# Altium schematic sheet Regulador_Inversor.SchDoc
size A4; SheetNumber: 1; SheetTotal: 1
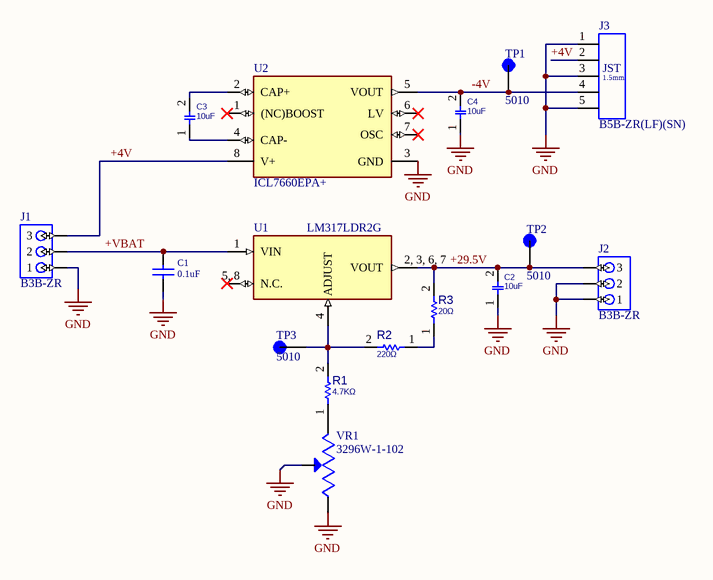
[diagram p0: Regulador_Inversor.SchDoc]

## Parts
C1  0.1uF  [CAPC2013X113X30LL10T10]
C2  10uF  [C1210]
C3  10uF  [C1210]
C4  10uF  [C1210]
J1  B3B-ZR  [B3B-ZR]
J2  B3B-ZR  [B3B-ZR]
J3  B5B-ZR(LF)(SN)  [JST_B5B-ZR(LF)(SN)]
R1  4.7KΩ  [R1206]
R2  220Ω  [R1206]
R3  20Ω  [R1206]
TP1  5010  [TP_5010]
TP2  5010  [TP_5010]
TP3  5010  [TP_5010]
U1  LM317LDR2G  [SOIC127P600X175-8N]
U2  ICL7660EPA+  [DIP794W47P254L991H457Q8]
VR1  3296W-1-102  [TRIM_3296W-1-102]

## Nets
GND: C1.1 C2.1 C4.1 J1.1 J2.1 J2.2 J3.1 J3.3 J3.5 U2.3(GND) VR1.1(CCW) VR1.2(WIPER)
+4V: J1.3 J3.2 U2.8(V+)
+29.5V: C2.2 J2.3 R3.2 TP2.TP U1.2,_3,_6,_7(VOUT)
+VBAT: C1.2 J1.2 U1.1(VIN)
-4V: C4.2 J3.4 TP1.TP U2.5(VOUT)
NetC3_1: C3.1 U2.4(CAP-)
NetC3_2: C3.2 U2.2(CAP+)
NetR1_1: R1.1 VR1.3(CW)
NetR1_2: R1.2 R2.2 TP3.TP U1.4(ADJUST)
NetR2_1: R2.1 R3.1

Not connected (* = marked no-connect by the designer): U1 5, 8(N.C.)*; U2 1((NC)BOOST)* 6(LV)* 7(OSC)*

## Notes on the sheet
- (in symbol B5B-ZR(LF)(SN)) 1.5mm

## Library data of the parts
C1 = 0805: 50V 0805
C2-C4 = CAP_SMD_FILM_1u16v_1210: 10 µF Molded Tantalum Capacitors 16 V 1411 (3528 Metric), 1210 500mOhm; ID: 478-5230-1-ND; ComponentLink1Description: Compra; ComponentLink1URL: https://www.digikey.com/en/products/detail/kyocera-avx/TPSB106K016R0500/1472653
J1 J2 = B3B-ZR: Connector Header Surface Mount 3 position 0.059 (1.50mm); MF: JST Sales; SnapEDA_Link: https://www.snapeda.com/parts/B3B-ZR/JST+Sales+America+Inc./view-part/?ref=snap; Package: None; Value: *; MP: B3B-ZR; Check_prices: https://www.snapeda.com/parts/B3B-ZR/JST+Sales+America+Inc./view-part/?ref=eda
J3 = B5B-ZR(LF)(SN): Conn Shrouded Header HDR 5 POS 1.5mm Solder ST Thru-Hole Box; MF: JST; SnapEDA_Link: https://www.snapeda.com/parts/B5B-ZR%20(LF)(SN)/JST/view-part/?ref=snap; Package: None; Value: *; MP: B5B-ZR (LF)(SN); Check_prices: https://www.snapeda.com/parts/B5B-ZR%20(LF)(SN)/JST/view-part/?ref=eda
R1-R3 = RES_SMD_1206: RESISTOR, SMD; ID: *; ComponentLink1Description: Compra; ComponentLink1URL: *
TP1-TP3 = 5010: Test Point MultiPurpose THM .445 L .125 OD Heat Resistant Nylon 46 Red | Keystone Electronics 5010; SnapEDA_Link: https://www.snapeda.com/parts/5010/Keystone/view-part/?ref=snap; Package: NON STANDARD-1 Keystone; Value: *; MF: Keystone Electronics; MP: 5010; Check_prices: https://www.snapeda.com/parts/5010/Keystone/view-part/?ref=eda
U1 = LM317LDR2G: Linear Voltage Regulator IC Positive Adjustable 1 Output 100mA 8-SOIC; MF: ON Semiconductor; SnapEDA_Link: https://www.snapeda.com/parts/LM317LDR2G/Onsemi/view-part/?ref=snap; Package: SOIC-8 ON Semiconductor; Value: *; MP: LM317LDR2G; Check_prices: https://www.snapeda.com/parts/LM317LDR2G/Onsemi/view-part/?ref=eda
U2 = ICL7660EPA+: Switched-Capacitor Voltage Converters; MF: Analog Devices; Price: None; Purchase-URL: https://pricing.snapeda.com/search/part/ICL7660EPA+/?ref=eda; Package: PDIP-8 Maxim; Check_prices: https://www.snapeda.com/parts/ICL7660EPA+/Analog+Devices/view-part/?ref=eda; Availability: In Stock; MP: ICL7660EPA+; Value: *; SnapEDA_Link: https://www.snapeda.com/parts/ICL7660EPA+/Analog+Devices/view-part/?ref=snap
VR1 = 3296W-1-102: TRIMMER - 3/8in SQ MT CERMET | Bourns 3296W-1-102; SnapEDA_Link: https://www.snapeda.com/parts/3296W-1-102/Bourns/view-part/?ref=snap; Package: NON STANDARD-3 Bourns; Value: *; MF: Bourns; MP: 3296W-1-102; Check_prices: https://www.snapeda.com/parts/3296W-1-102/Bourns/view-part/?ref=eda